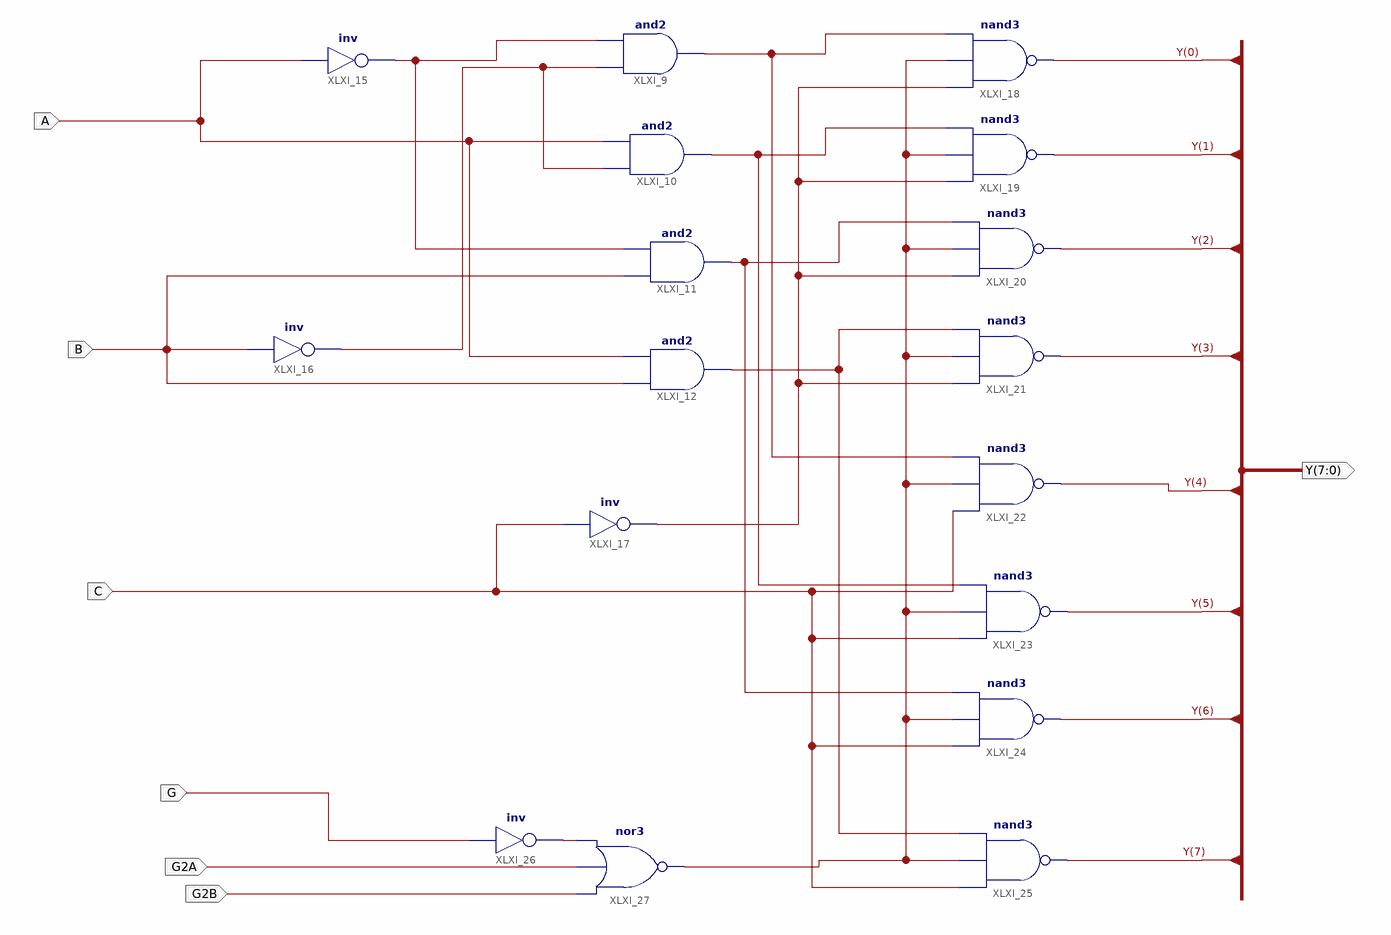
[diagram p0: schematic sheet 1]
// Xilinx ISE schematic D_74LS138.sch (kintex7) as structural Verilog: 17 symbols, 7 ports
module D_74LS138 (
  input  A,
  input  C,
  input  G2A,
  input  G2B,
  input  G,
  input  B,
  output [7:0] Y
);

  wire XLXN_5, XLXN_10, XLXN_16, XLXN_18, XLXN_20, XLXN_22, XLXN_23, XLXN_26, XLXN_59;

  and XLXI_9 (XLXN_18, XLXN_10, XLXN_5);
  and XLXI_10 (XLXN_20, XLXN_10, A);
  and XLXI_11 (XLXN_22, B, XLXN_5);
  and XLXI_12 (XLXN_23, B, A);
  not XLXI_15 (XLXN_5, A);
  not XLXI_16 (XLXN_10, B);
  not XLXI_17 (XLXN_16, C);
  nand XLXI_18 (Y[0], XLXN_16, XLXN_26, XLXN_18);
  nand XLXI_19 (Y[1], XLXN_16, XLXN_26, XLXN_20);
  nand XLXI_20 (Y[2], XLXN_16, XLXN_26, XLXN_22);
  nand XLXI_21 (Y[3], XLXN_16, XLXN_26, XLXN_23);
  nand XLXI_22 (Y[4], C, XLXN_26, XLXN_18);
  nand XLXI_23 (Y[5], C, XLXN_26, XLXN_20);
  nand XLXI_24 (Y[6], C, XLXN_26, XLXN_22);
  nand XLXI_25 (Y[7], C, XLXN_26, XLXN_23);
  not XLXI_26 (XLXN_59, G);
  nor XLXI_27 (XLXN_26, G2B, G2A, XLXN_59);
endmodule
